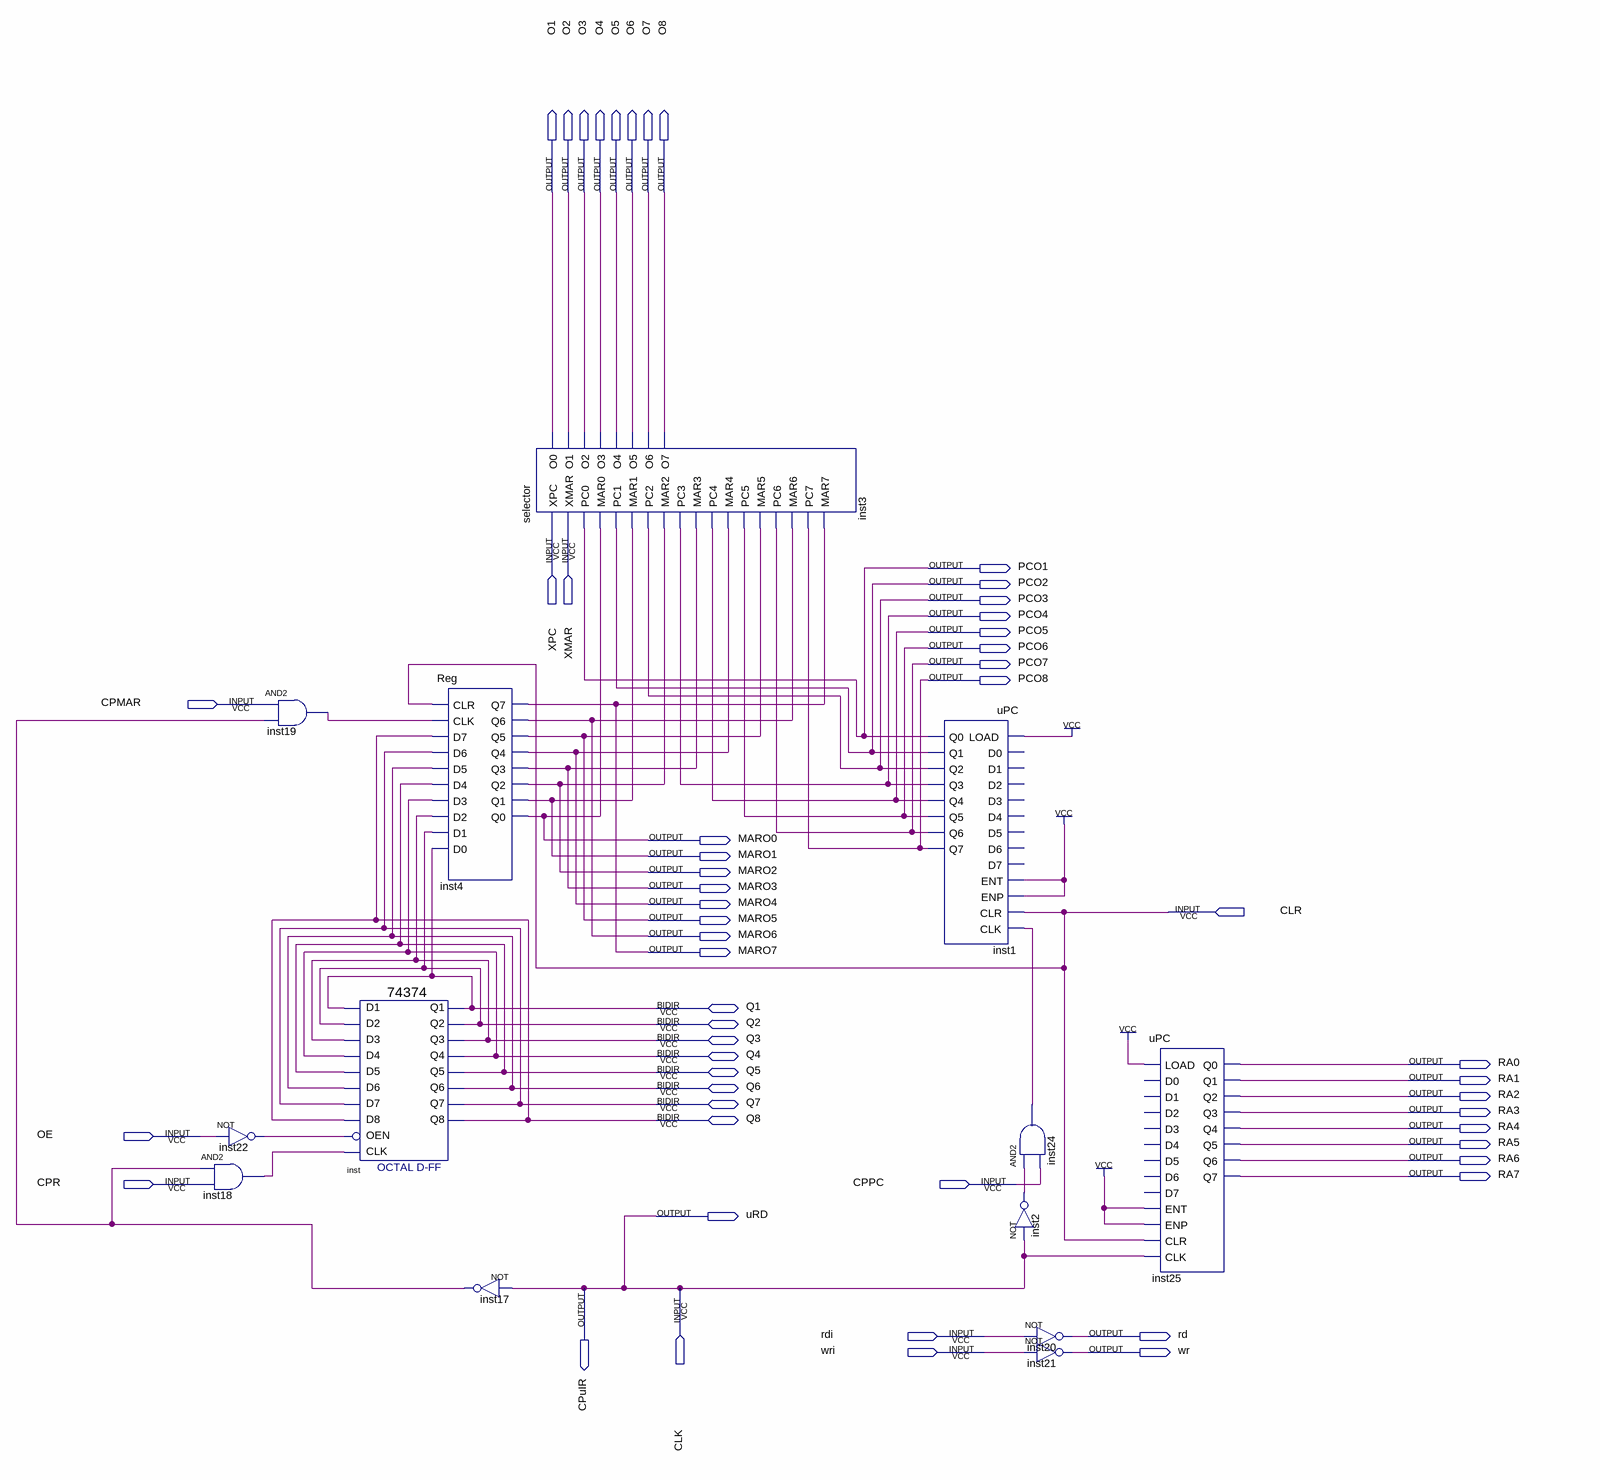
[diagram p0: schematic sheet]
// Quartus schematic EXP2.bdf as structural Verilog: 13 symbols, 54 pins
module EXP2 (
  input  XPC,
  input  XMAR,
  input  CPMAR,
  input  CLR,
  input  OE,
  input  CPR,
  input  CPPC,
  input  CLK,
  input  rdi,
  input  wri,
  inout  Q1,
  inout  Q2,
  inout  Q3,
  inout  Q4,
  inout  Q5,
  inout  Q6,
  inout  Q7,
  inout  Q8,
  output O1,
  output O2,
  output O3,
  output O4,
  output O5,
  output O6,
  output O7,
  output O8,
  output PCO1,
  output PCO2,
  output PCO3,
  output PCO4,
  output PCO5,
  output PCO6,
  output PCO7,
  output PCO8,
  output MARO0,
  output MARO1,
  output MARO2,
  output MARO3,
  output MARO4,
  output MARO5,
  output MARO6,
  output MARO7,
  output RA0,
  output RA1,
  output RA2,
  output RA3,
  output RA4,
  output RA5,
  output RA6,
  output RA7,
  output uRD,
  output CPuIR,
  output rd,
  output wr
);

  wire inst2_out, inst17_out, inst18_out, inst19_out, inst22_out, inst24_out;

  not inst22 (inst22_out, OE);
  and inst18 (inst18_out, inst17_out, CPR);
  and inst19 (inst19_out, CPMAR, inst17_out);
  \74374  inst (
    .D1(Q1), .D2(Q2), .D3(Q3), .D4(Q4), .D6(Q6), .D5(Q5), .OEN(inst22_out), .D8(Q8), .D7(Q7),
    .CLK(inst18_out), .Q2(Q2), .Q3(Q3), .Q5(Q5), .Q4(Q4), .Q6(Q6), .Q7(Q7), .Q8(Q8), .Q1(Q1));
  Reg inst4 (
    .CLR(CLR), .CLK(inst19_out), .D7(Q8), .D6(Q7), .D5(Q6), .D4(Q5), .D3(Q4), .D2(Q3), .D1(Q2), .D0(Q1),
    .Q7(MARO7), .Q6(MARO6), .Q5(MARO5), .Q4(MARO4), .Q3(MARO3), .Q2(MARO2), .Q1(MARO1), .Q0(MARO0));
  not inst17 (inst17_out, CLK);
  selector inst3 (
    .XPC(XPC), .XMAR(XMAR), .PC0(PCO1), .MAR0(MARO0), .PC1(PCO2), .MAR1(MARO1), .PC2(PCO3), .MAR2(MARO2),
    .PC3(PCO4), .MAR3(MARO3), .PC4(PCO5), .MAR4(MARO4), .PC5(PCO6), .MAR5(MARO5), .PC6(PCO7), .MAR6(MARO6),
    .PC7(PCO8), .MAR7(MARO7), .O0(O1), .O1(O2), .O2(O3), .O3(O4), .O4(O5), .O5(O6), .O6(O7), .O7(O8));
  uPC inst1 (
    .LOAD(1'b1), .ENT(1'b1), .ENP(1'b1), .CLR(CLR), .CLK(inst24_out), .Q0(PCO1), .Q1(PCO2), .Q2(PCO3),
    .Q3(PCO4), .Q4(PCO5), .Q5(PCO6), .Q6(PCO7), .Q7(PCO8));  // open: D0, D1, D2, D3, D4, D5, D6, D7
  and inst24 (inst24_out, inst2_out, CPPC);
  not inst2 (inst2_out, CLK);
  not inst20 (rd, rdi);
  not inst21 (wr, wri);
  uPC inst25 (
    .LOAD(1'b1), .ENT(1'b1), .ENP(1'b1), .CLR(CLR), .CLK(CLK), .Q0(RA0), .Q1(RA1), .Q2(RA2), .Q3(RA3),
    .Q4(RA4), .Q5(RA5), .Q6(RA6), .Q7(RA7));  // open: D0, D1, D2, D3, D4, D5, D6, D7

  assign CPuIR = CLK;
  assign uRD = CLK;
endmodule
